# EAGLE design GLCD-Shield_v10 (EAGLE 7.5.0)
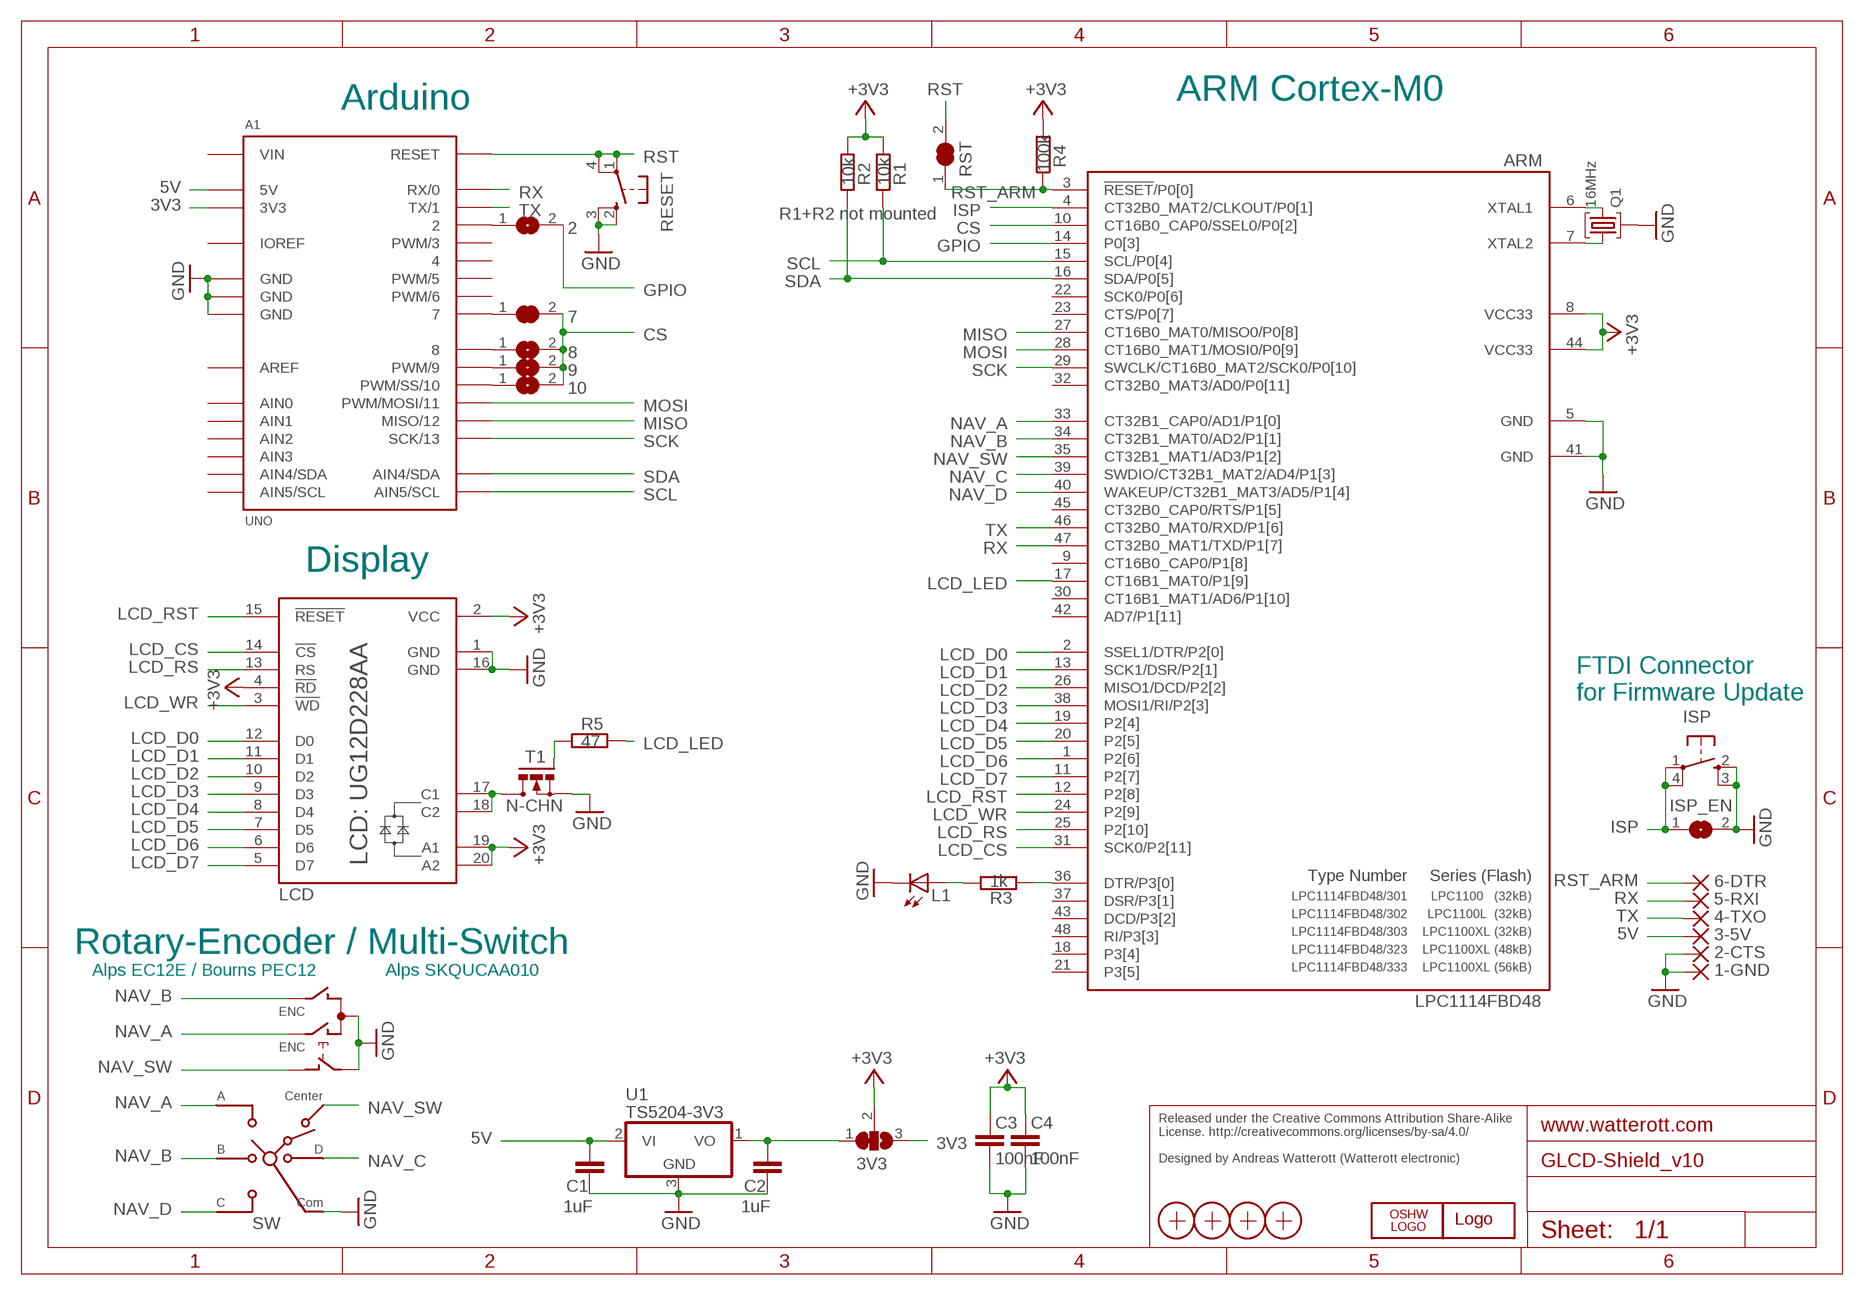
[diagram p0: schematic, sheet 1]

## Parts
1-GND  WIREPADSMD1,27-254  [SMD1,27-2,54]
2  SJ  [SJ]
2-CTS  WIREPADSMD1,27-254  [SMD1,27-2,54]
3-5V  WIREPADSMD1,27-254  [SMD1,27-2,54]
3V3  SJ2W  [SJ_2]
4-TXO  WIREPADSMD1,27-254  [SMD1,27-2,54]
5-RXI  WIREPADSMD1,27-254  [SMD1,27-2,54]
6-DTR  WIREPADSMD1,27-254  [SMD1,27-2,54]
7  SJ  [SJ]
8  SJ  [SJ]
9  SJ  [SJ]
10  SJ  [SJ]
A1  UNO  [UNO]
ARM  LPC1114FBD48  LPC111X  [LQFP48]
C1  1uF  C-EUC0603  [C0603]
C2  1uF  C-EUC0603  [C0603]
C3  100nF  C-EUC0603  [C0603]
C4  100nF  C-EUC0603  [C0603]
ENC  EC12E_SW  [ALPS_EC12E_SW]
ISP  SW_SMDS  [SW_SMD4@1]
ISP_EN  SJ  [SJ]
L1  LEDCHIPLED_0603  [CHIPLED_0603]
LCD  UG12D228AA  [UG12D228AA]
LOGO1  OSHW_LOGO_6MILX0100-NT  [OSHW_6X100_NOTEXT]
Q1  16MHz  SMD_OSC2  [SMD_OSC_35X15]
R1  10k  R-EU_R0603  [R0603]
R2  10k  R-EU_R0603  [R0603]
R3  1k  R-EU_R0603  [R0603]
R4  100k  R-EU_R0603  [R0603]
R5  47  R-EU_R0603  [R0603]
RESET  SW_SMDS  [SW_SMD4@1]
RST  SJ  [SJ]
SW  SKQUCAA010  [SKQU]
T1  N-CHN  IRLML2502  [MICRO3]
U1  TS5204-3V3  TS5204  [SOT23]
U$1  WE-LOGOPLACE  [WE-LOGO]
X1  PASSER  [PASSER]
X2  PASSER  [PASSER]
X3  PASSER  [PASSER]
X4  PASSER  [PASSER]

## Nets
2X: 2.1 A1.2
3V3: 3V3.3 A1.3V3
3V_OUT: 3V3.1 C2.1 U1.1(VO)
5V: 3-5V.1(P) A1.5V C1.1 U1.2(VI)
7: 7.1 A1.7
8: 8.1 A1.8
9: 9.1 A1.9(PWM/9)
10: 10.1 A1.10(PWM/SS/10)
+3V3: 3V3.2 ARM.8(VCC33) ARM.44(VCC33) C3.1 C4.1 LCD.2(VCC) LCD.4(!RD) LCD.19(A1) LCD.20(A2) R1.2 R2.2 R4.2
C: LCD.17(C1) LCD.18(C2) T1.3(D)
CS: 7.2 8.2 9.2 10.2 ARM.10(CT16B0_CAP0/SSEL0/P0[2])
GND: 1-GND.1(P) 2-CTS.1(P) A1.GND@1(GND) A1.GND@2(GND) A1.GND@3(GND) ARM.5(GND) ARM.41(GND) C1.2 C2.2 C3.2 C4.2 ENC.C ENC.E ISP.2(S) ISP.3(S1) ISP_EN.2 L1.C LCD.1(GND) LCD.16(GND) Q1.GND RESET.2(S) RESET.3(S1) SW.COMMON T1.2(S) U1.3(GND)
GPIO: 2.2 ARM.14(P0[3])
ISP: ARM.4(CT32B0_MAT2/CLKOUT/P0[1]) ISP.1(P) ISP.4(P1) ISP_EN.1
LCD_CS: ARM.31(SCK0/P2[11]) LCD.14(!CS)
LCD_D0: ARM.2(SSEL1/DTR/P2[0]) LCD.12(D0)
LCD_D1: ARM.13(SCK1/DSR/P2[1]) LCD.11(D1)
LCD_D2: ARM.26(MISO1/DCD/P2[2]) LCD.10(D2)
LCD_D3: ARM.38(MOSI1/RI/P2[3]) LCD.9(D3)
LCD_D4: ARM.19(P2[4]) LCD.8(D4)
LCD_D5: ARM.20(P2[5]) LCD.7(D5)
LCD_D6: ARM.1(P2[6]) LCD.6(D6)
LCD_D7: ARM.11(P2[7]) LCD.5(D7)
LCD_LED: ARM.17(CT16B1_MAT0/P1[9]) R5.2
LCD_RS: ARM.25(P2[10]) LCD.13(RS)
LCD_RST: ARM.12(P2[8]) LCD.15(!RESET)
LCD_WR: ARM.24(P2[9]) LCD.3(!WD)
LED: ARM.36(DTR/P3[0]) R3.1
LEDPWM: R5.1 T1.1(G)
MISO: A1.12(MISO/12) ARM.27(CT16B0_MAT0/MISO0/P0[8])
MOSI: A1.11(PWM/MOSI/11) ARM.28(CT16B0_MAT1/MOSI0/P0[9])
N$1: ARM.6(XTAL1) Q1.2
N$5: ARM.7(XTAL2) Q1.1
N$12: L1.A R3.2
NAV_A: ARM.33(CT32B1_CAP0/AD1/P1[0]) ENC.A SW.A
NAV_B: ARM.34(CT32B1_MAT0/AD2/P1[1]) ENC.B SW.B
NAV_C: ARM.39(SWDIO/CT32B1_MAT2/AD4/P1[3]) SW.D
NAV_D: ARM.40(WAKEUP/CT32B1_MAT3/AD5/P1[4]) SW.C
NAV_SW: ARM.35(CT32B1_MAT1/AD3/P1[2]) ENC.D SW.CENTER
RST: A1.RST(RESET) RESET.1(P) RESET.4(P1) RST.2
RST_ARM: 6-DTR.1(P) ARM.3(!RESET!/P0[0]) R4.1 RST.1
RX: 5-RXI.1(P) A1.0(RX/0) ARM.47(CT32B0_MAT1/TXD/P1[7])
SCK: A1.13(SCK/13) ARM.29(SWCLK/CT16B0_MAT2/SCK0/P0[10])
SCL: A1.SCL(AIN5/SCL) ARM.15(SCL/P0[4]) R1.1
SDA: A1.SDA(AIN4/SDA) ARM.16(SDA/P0[5]) R2.1
TX: 4-TXO.1(P) A1.1(TX/1) ARM.46(CT32B0_MAT0/RXD/P1[6])
Unconnected: A1.3(PWM/3) A1.4 A1.5(PWM/5) A1.6(PWM/6) A1.AIN0 A1.AIN1 A1.AIN2 A1.AIN3 A1.AIN4(AIN4/SDA) A1.AIN5(AIN5/SCL) ARM.9(CT16B0_CAP0/P1[8]) ARM.18(P3[4]) ARM.21(P3[5]) ARM.22(SCK0/P0[6]) ARM.23(CTS/P0[7]) ARM.30(CT16B1_MAT1/AD6/P1[10]) ARM.32(CT32B0_MAT3/AD0/P0[11]) ARM.37(DSR/P3[1]) ARM.42(AD7/P1[11]) ARM.43(DCD/P3[2]) ARM.45(CT32B0_CAP0/RTS/P1[5]) ARM.48(RI/P3[3]) ENC.GND1(G) ENC.GND2(G)

## Notes on the sheet
- Arduino | ARM Cortex-M0
- R1+R2 not mounted
- Display
- FTDI Connector
- for Firmware Update
- Type Number | Series (Flash)
- LPC1114FBD48/301 | LPC1100   (32kB)
- LPC1114FBD48/302 | LPC1100L  (32kB)
- LPC1114FBD48/303 | LPC1100XL (32kB)
- LPC1114FBD48/323 | LPC1100XL (48kB)
- Rotary-Encoder / Multi-Switch
- LPC1114FBD48/333 | LPC1100XL (56kB)
- Alps EC12E / Bourns PEC12 | Alps SKQUCAA010
- Released under the Creative Commons Attribution Share-Alike 
  License. http://creativecommons.org/licenses/by-sa/4.0/
  
  Designed by Andreas Watterott (Watterott electronic)

## Power pins joined to a net without a drawn wire
AREF: A1.AREF
IOREF: A1.IOREF
VIN: A1.VIN

## Library data of the parts
1-GND 2-CTS 3-5V 4-TXO 5-RXI 6-DTR = wirepad:WIREPAD: Wire PAD connect wire on PCB
2 7-10 ISP_EN RST = jumper:SJ: SMD solder JUMPER
3V3 = jumper:SJ2W: SMD solder JUMPER
A1 = Arduino:UNO
ARM = ARM:LPC111X: NXP LPC1113/14
C1-C4 = rcl:C-EU: CAPACITOR, European symbol
ENC = Encoder-IR:EC12E_SW: ALPS EC12E Rotary Encoder with switch
ISP RESET = Switch-SMD:SW_SMD
L1 = led:LED: LED OSRAM: - CHIPLED LG R971, LG N971, LY N971, LG Q971, LY Q971, LO R971, LY R971 LH N974, LH R974 LS Q976, LO Q976, LY Q976 LO Q996 - Hyper CHIPLED LW Q18S LB Q993, LB Q99A, LB R99A - SideLED LS A670, LO A670, LY A670, LG A670, LP A670 LB A673, LV A673, LT A673, LW A673 LH A674 LY A675 LS A676, LA A676, LO A676, LY A676, LW A676 LS A679, LY A679, LG A679 - Hyper Micro SIDELED® LS Y876, LA Y876, LO Y876, LY Y876 LT Y87S - SmartLED LW L88C, LW L88S LB L89C, LB L89S, LG L890 LS L89K, LO L89K, LY L89K LS L896, LA L896, LO L896, LY L896 - TOPLED LS T670, LO T670, LY T670, LG T670, LP T670 LSG T670, LSP T670, LSY T670, LOP T670, LYG T670 LG T671, LOG T671, LSG T671 LB T673, LV T673, LT T673, LW T673 LH T674 LS T676, LA T676, LO T676, LY T676, LB T676, LH T676, LSB T676, LW T676 LB T67C, LV T67C, LT T67C, LS T67K, LO T67K, LY T67K, LW E67C LS E67B, LA E67B, LO E67B, LY E67B, LB E67C, LV E67C, LT E67C LW T67C LS T679, LY T679, LG T679 LS T770, LO T770, LY T770, LG T770, LP T770 LB T773, LV T773, LT T773, LW T773 LH T774 LS E675, LA E675, LY E675, LS T675 LS T776, LA T776, LO T776, LY T776, LB T776 LHGB T686 LT T68C, LB T68C - Hyper Mini TOPLED® LB M676 - Mini TOPLED Santana® LG M470 LS M47K, LO M47K, LY M47K Source: http://www.osram.convergy.de LUXEON: - LUMILED® LXK2-PW12-R00, LXK2-PW12-S00, LXK2-PW14-U00, LXK2-PW14-V00 LXK2-PM12-R00, LXK2-PM12-S00, LXK2-PM14-U00 LXK2-PE12-Q00, LXK2-PE12-R00, LXK2-PE12-S00, LXK2-PE14-T00, LXK2-PE14-U00 LXK2-PB12-K00, LXK2-PB12-L00, LXK2-PB12-M00, LXK2-PB14-N00, LXK2-PB14-P00, LXK2-PB14-Q00 LXK2-PR12-L00, LXK2-PR12-M00, LXK2-PR14-Q00, LXK2-PR14-R00 LXK2-PD12-Q00, LXK2-PD12-R00, LXK2-PD12-S00 LXK2-PH12-R00, LXK2-PH12-S00 LXK2-PL12-P00, LXK2-PL12-Q00, LXK2-PL12-R00 Source: www.luxeon.com KINGBRIGHT: KA-3528ASYC Source: www.kingbright.com
LCD = Display:UG12D228AA: Samsung UG12D228AA
LOGO1 = OSHW:OSHW_LOGO_6MIL
Q1 = Crystal:SMD_OSC
R1-R5 = rcl:R-EU_: RESISTOR, European symbol
SW = Encoder-Nav-IR:SKQU: Multi Control Devices TACT Switch - 4-directional with Center Push Type. SKQU Series.; MF: ALPS; OC_ADAFRUIT: 504; OC_MOUSER: 688-SKQUCA; OC_NEWARK: 59M1983
T1 = IRF-sot23:IRLML2502: N-Channel Power MOSFET
U1 = Voltage-Reg:TS5204
U$1 = welectronic:WE-LOGO
X1-X4 = SMD:PASSER

## Board
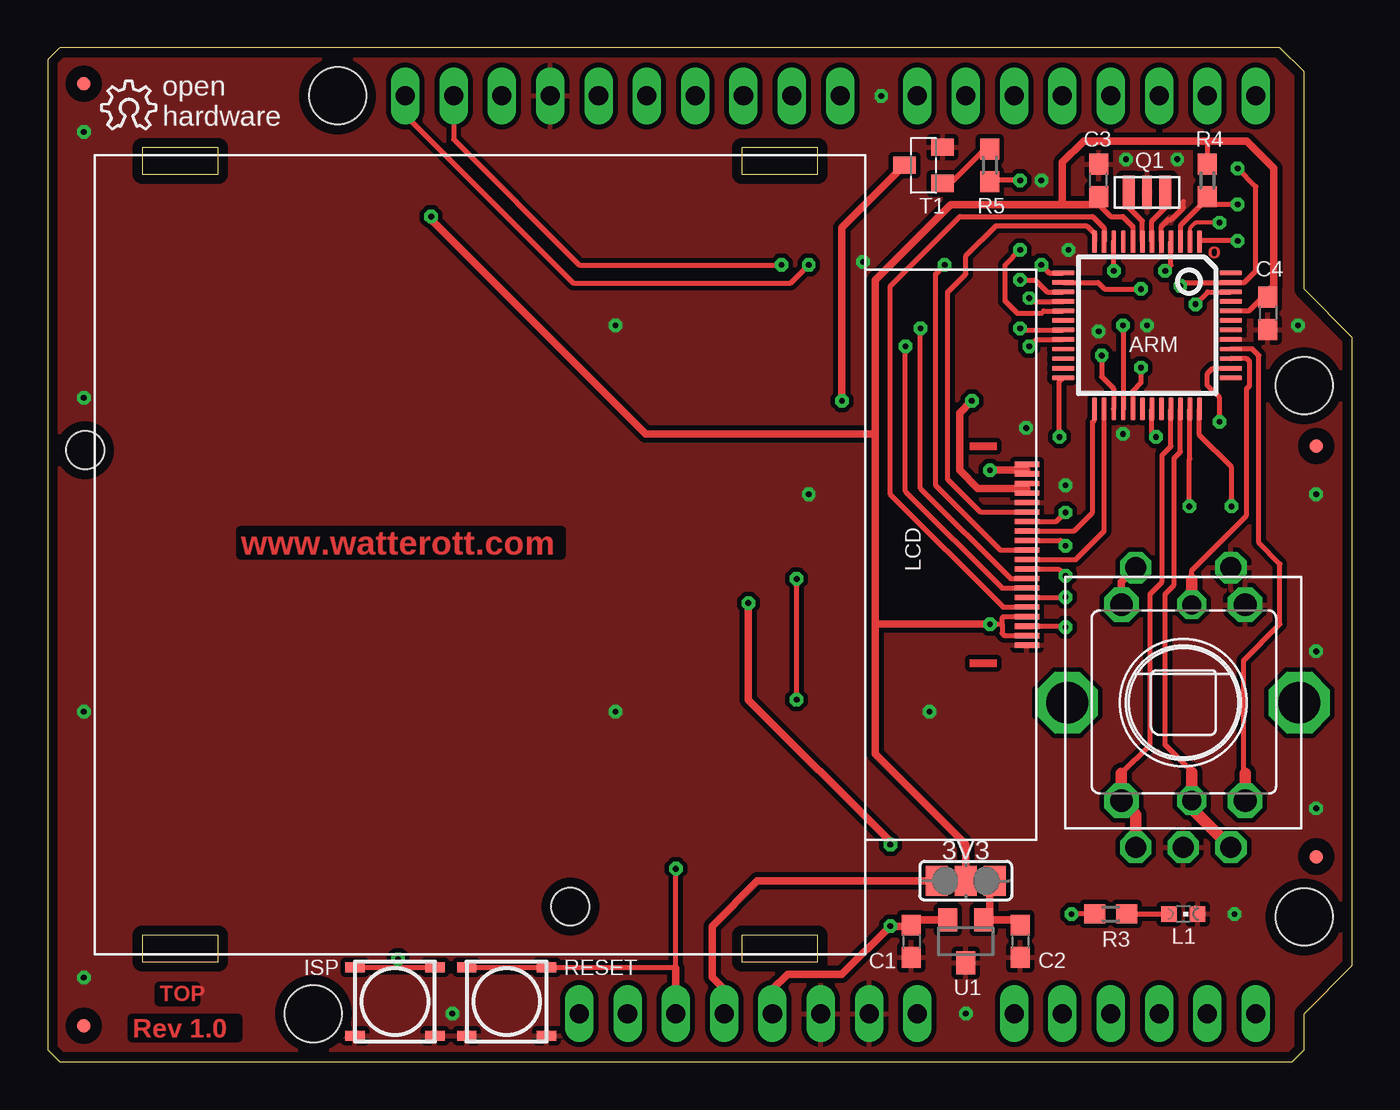
[diagram p1: board, top side]
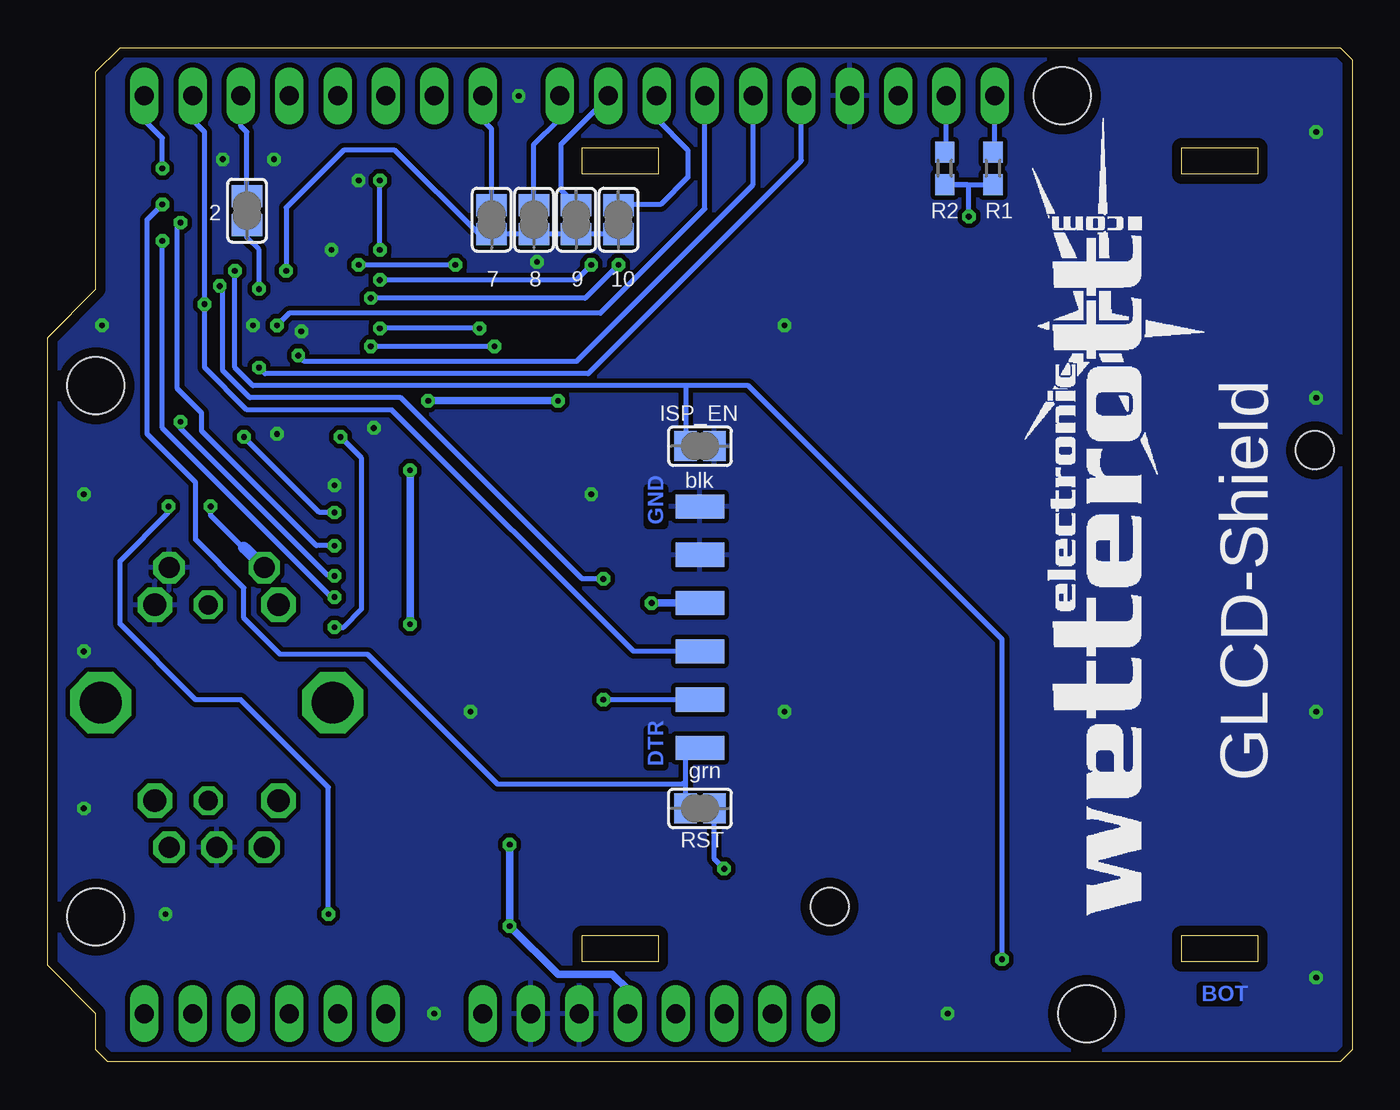
[diagram p2: board, bottom side, seen from below]

Size 68.58 x 53.34 mm. Coordinates in mm from the lower left corner, seen from the top.
Copper layers (1*16): Top 0.035mm / dielectric 1.5mm / Bottom 0.035mm
Design rules "default *": minimum track width 8mil, minimum drill 0.3mm, track to track 8mil, track to pad 8mil, pad to pad 8mil, via to via 8mil, smd to smd 8mil, copper to edge 20mil, drill to drill 8mil, minimum pad ring 10mil, minimum via ring 8mil, stop-mask expansion 4mil, vias tented up to drill 0.5mm, thermal gap 10mil
tRestrict: area 56.5,44.9 to 57.1,46.5; area 58.4,44.9 to 59.1,46.5

### Footprints (pad centres in the part's own frame; a part is rotated, then mirrored left to right if it is on the bottom)
SMD1,27-2,54 = smd 1.27 x 2.54: 1 0,0
SJ = smd 1.168 x 1.6: 1 -0.762,0; 2 0.762,0
SJ_2 = smd 1.168 x 1.6: 1 -1.524,0; 2 0,0; 3 1.524,0
UNO = drill 1 long: 0 63.5,50.8; 1 60.96,50.8; 2 58.42,50.8; 3 55.88,50.8; 3V3 35.56,2.54; 4 53.34,50.8; 5 50.8,50.8; 5V 38.1,2.54; 6 48.26,50.8; 7 45.72,50.8; 8 41.656,50.8; 9 39.116,50.8; 10 36.576,50.8; 11 34.036,50.8; 12 31.496,50.8; 13 28.956,50.8; AIN0 50.8,2.54; AIN1 53.34,2.54; AIN2 55.88,2.54; AIN3 58.42,2.54; AIN4 60.96,2.54; AIN5 63.5,2.54; AREF 23.876,50.8; GND@1 40.64,2.54; GND@2 43.18,2.54; GND@3 26.416,50.8; IOREF 30.48,2.54; NC 27.94,2.54; RST 33.02,2.54; SCL 18.796,50.8; SDA 21.336,50.8; VIN 45.72,2.54 | hole 3: 66.04,35.56; 66.04,7.62; 15.24,50.8; 13.97,2.54
LQFP48 = smd 1.2 x 0.26: 1 -4.4,2.75; 2 -4.4,2.25; 3 -4.4,1.75; 4 -4.4,1.25; 5 -4.4,0.75; 6 -4.4,0.25; 7 -4.4,-0.25; 8 -4.4,-0.75; 9 -4.4,-1.25; 10 -4.4,-1.75; 11 -4.4,-2.25; 12 -4.4,-2.75; 25 4.4,-2.75; 26 4.4,-2.25; 27 4.4,-1.75; 28 4.4,-1.25; 29 4.4,-0.75; 30 4.4,-0.25; 31 4.4,0.25; 32 4.4,0.75; 33 4.4,1.25; 34 4.4,1.75; 35 4.4,2.25; 36 4.4,2.75 | smd 0.26 x 1.2: 13 -2.75,-4.4; 14 -2.25,-4.4; 15 -1.75,-4.4; 16 -1.25,-4.4; 17 -0.75,-4.4; 18 -0.25,-4.4; 19 0.25,-4.4; 20 0.75,-4.4; 21 1.25,-4.4; 22 1.75,-4.4; 23 2.25,-4.4; 24 2.75,-4.4; 37 2.75,4.4; 38 2.25,4.4; 39 1.75,4.4; 40 1.25,4.4; 41 0.75,4.4; 42 0.25,4.4; 43 -0.25,4.4; 44 -0.75,4.4; 45 -1.25,4.4; 46 -1.75,4.4; 47 -2.25,4.4; 48 -2.75,4.4
C0603 = smd 1.1 x 1: 1 -0.85,0; 2 0.85,0
ALPS_EC12E_SW = drill 1.1 octagon: A -2.5,-7.6; B 2.5,-7.6; C 0,-7.6; D -2.5,7.1; E 2.5,7.1 | drill 2.2 octagon: GND1 -6.1,0; GND2 6.1,0
SW_SMD4@1 = smd 0.508 x 1.016: 1 -1.8,-2.1; 2 1.8,-2.1; 3 1.8,2.1; 4 -1.8,2.1
CHIPLED_0603 = smd 0.8 x 0.8: A 0,-0.75; C 0,0.75
UG12D228AA = smd 0.279 x 1.27: 1 -4.75,-7.5; 2 -4.25,-7.5; 3 -3.75,-7.5; 4 -3.25,-7.5; 5 -2.75,-7.5; 6 -2.25,-7.5; 7 -1.75,-7.5; 8 -1.25,-7.5; 9 -0.75,-7.5; 10 -0.25,-7.5; 11 0.25,-7.5; 12 0.75,-7.5; 13 1.25,-7.5; 14 1.75,-7.5; 15 2.25,-7.5; 16 2.75,-7.5; 17 3.25,-7.5; 18 3.75,-7.5; 19 4.25,-7.5; 20 4.75,-7.5 | hole 2: 5.5,42; -18.5,16.5
SMD_OSC_35X15 = smd 0.635 x 1.778: 1 -0.965,0; 2 0.965,0 | smd 0.508 x 1.778: GND 0,0
R0603 = smd 1.1 x 1: 1 -0.85,0; 2 0.85,0
SKQU = drill 1.2 octagon: A -5.15,3.25; C -5.15,-3.25; CENTER 5.15,3.25; COMMON 5.15,-3.25 | drill 1 octagon: B -5.15,-0.45; D 5.15,-0.45
MICRO3 = smd 0.9 x 1.2: 1 -0.95,-1; 2 0.95,-1; 3 0,1
SOT23 = smd 1 x 1.2: 1 -0.95,-1.132; 2 0.95,-1.132; 3 0,1.132
PASSER = smd 0.7 x 0.7: X 0,0

### Placement (x,y rotation side)
1-GND  34.29,29.21 270 bottom
2  58.1,44.77 270 bottom
2-CTS  34.29,26.67 270 bottom
3-5V  34.29,24.13 270 bottom
3V3  48.26,9.53 180 top
4-TXO  34.29,21.59 270 bottom
5-RXI  34.29,19.05 270 bottom
6-DTR  34.29,16.51 270 bottom
7  45.24,44.29 270 bottom
8  43.02,44.29 270 bottom
9  40.8,44.29 270 bottom
10  38.58,44.29 270 bottom
A1  0,0 0 top
ARM  57.78,38.73 270 top
C1  45.4,6.35 270 top
C2  51.12,6.35 270 top
C3  55.24,46.35 90 top
C4  64.14,39.37 270 top
ENC  59.69,18.89 0 top
ISP  18.26,3.17 270 top
ISP_EN  34.29,32.38 0 bottom
L1  59.69,7.78 270 top
LCD  43.97,26.67 90 top
LOGO1  2.86,49.05 0 top
Q1  57.78,45.72 0 top
R1  18.89,46.99 270 bottom
R2  21.43,46.99 270 bottom
R3  55.88,7.78 0 top
R4  60.96,46.35 90 top
R5  49.53,47.15 270 top
RESET  24.13,3.17 270 top
RST  34.29,13.34 0 bottom
SW  59.69,18.89 90 top
T1  46.04,47.15 90 top
U1  48.26,6.35 180 top
U$1  7.46,7.46 90 bottom
X1  1.91,1.91 0 top
X2  1.91,51.44 0 top
X3  66.67,32.38 0 top
X4  66.67,10.79 0 top

### Tracks (layer width: path | path; a pad name or v marks a point on that pad's centre or on a via)
2X
  Bottom 0.254: A1.2 58.42,49.21 58.1,48.9 2.1
3V3
  Top 0.406: A1.3V3 35.56,3.81 34.92,4.45 34.92,7.14 37.31,9.53 3V3.3
3V_OUT
  Top 0.254: 49.53,9.53 3V3.1
  Top 0.406: C2.1 50.84,7.48 U1.1 49.53,7.8 49.53,9.53
5V  (via drill 0.3)
  Top 0.406: U1.2 45.68,7.48 C1.1 45.35,7.14 v44.29,7.14 41.75,4.6 38.89,4.6 38.1,3.81 A1.5V | v44.29,11.43 44.29,11.59 36.83,19.05 v36.83,24.13
  Bottom 0.406: A1.5V 38.1,3.81 38.89,4.6 41.75,4.6 v44.29,7.14 v44.29,11.43 | v36.83,24.13 3-5V.1
7
  Bottom 0.254: A1.7 45.72,49.53 45.24,49.05 7.1
8
  Bottom 0.254: 8.1 43.02,48.26 41.75,49.53 41.75,50.7 A1.8
9
  Bottom 0.254: A1.9 39.12,50.74 41.59,48.26 41.59,45.85 9.1
10
  Bottom 0.254: A1.10 36.58,49.59 34.92,47.94 34.92,46.51 36.35,45.09 38.55,45.09 10.1
+3V3  (via drill 0.3)
  Top 0.254: LCD.2 50.29,22.42 50.16,22.54 50.16,23.02 | LCD.4 50.25,23.42 50.16,23.34 50.16,23.02 | 60.96,48.42 R4.2 | ARM.8 57.03,43.93 56.52,44.45 55.88,44.45 55.24,45.09 C3.1 | ARM.44 63.14,39.48 63.82,40.16 64.08,40.16 C4.1 | LCD.19 51.47,31.11 LCD.20 | v49.53,23.02 50.16,23.02
  Top 0.406: 63.82,40.16 64.45,40.8 64.45,46.99 63.02,48.42 60.96,48.42 54.45,48.42 53.34,47.31 53.34,45.09 | 53.34,45.09 55.24,45.09 | 53.34,45.09 47.47,45.09 43.5,41.12 43.5,33.02 | 3V3.2 48.26,11.43 43.5,16.19 43.5,23.02 | 43.5,23.02 43.5,33.02 | 43.5,33.02 31.43,33.02 20.16,44.29 v20.16,44.45 | 43.5,23.02 v49.53,23.02 | 49.69,31.11 51.47,31.11 | v49.53,31.11 49.69,31.11 | 49.69,31.11
  Bottom 0.254: R2.2 R1.2 | R2.2 | R2.2 20.26,46.14 20.16,46.04 v20.16,44.45
  Bottom 0.406: v49.53,23.02 v49.53,31.11
C  (via drill 0.3)
  Top 0.254: LCD.17 51.47,30.16 LCD.18
  Top 0.406: v41.75,34.77 41.75,43.86 T1.3 | v48.58,34.77 47.94,34.13 47.94,31.11 48.9,30.16 51.47,30.16
  Bottom 0.254: v48.58,34.77
  Bottom 0.406: v41.75,34.77 v48.58,34.77
CS  (via drill 0.3)
  Top 0.254: ARM.10 v56.03,41.6 v56.04,41.59
  Bottom 0.254: v56.04,41.59 56.04,44.93 53.02,47.94 50.32,47.94 45.88,43.5 45.28,43.5 7.2 8.2 9.2 | 10.2 9.2 | 9.2
GND  (via drill 0.3)
  Top 0.254: ARM.5 58.53,43.93 58.9,44.29 59.05,44.29 59.69,44.93 59.69,45.24
  other vias: 1.91,34.92 1.91,18.41 56.67,47.47 52.23,46.35 53.5,30.32 65.72,38.73 42.86,42.07 57.78,38.74 51.44,33.34 53.66,42.7 59.37,47.47 66.67,13.34 66.67,29.85 48.26,2.54 46.35,18.42 1.91,4.45 1.91,48.9 29.84,18.42 29.84,38.74 21.27,2.54 40.01,29.85 56.52,33.02 62.39,7.78 66.67,21.59 43.81,50.8 55.25,38.42
  pour Bottom (isolate 0.254): 0,53.34 68.58,53.34 68.58,0 0,0
  pour Top (isolate 0.254): 0,0 0,53.34 68.58,53.34 68.58,0
GPIO  (via drill 0.3)
  Top 0.254: ARM.14 55.22,40.98 55.56,40.64 v57.47,40.64
  Bottom 0.254: 2.2 58.1,43.34 57.47,42.7 v57.47,40.64
ISP  (via drill 0.3)
  Top 0.254: ARM.4 59.03,41.89 v58.74,41.59 | ISP.1 18.57,4.97 | 18.57,4.97 ISP.4 | v18.41,5.4 18.41,5.13 18.57,4.97
  Bottom 0.254: v58.74,41.59 58.74,36.51 57.78,35.56 35.08,35.56 | 35.24,32.58 ISP_EN.1 35.05,35.53 35.08,35.56 | v18.41,5.4 18.41,22.23 31.75,35.56 35.08,35.56
LCD_CS  (via drill 0.3)
  Top 0.254: LCD.14 53.03,28.42 v53.5,28.89 | ARM.31 58.03,33.09 v58.26,32.86
  Bottom 0.254: v53.5,28.89 54.29,28.89 v58.26,32.86
LCD_D0  (via drill 0.3)
  Top 0.203: ARM.2 60.03,43.84 60.33,44.13 v61.59,44.13
  Top 0.254: LCD.12 53.23,27.42 v53.5,27.15
  Bottom 0.254: v61.59,44.13 61.75,43.97 61.75,35.4 60.48,34.13 60.48,33.18 54.45,27.15 v53.5,27.15 | v61.59,44.13 | v53.5,27.15
LCD_D1  (via drill 0.3)
  Top 0.254: ARM.13 52.65,41.48 v52.23,41.91 | LCD.11 50.07,26.92 46.67,30.32 46.67,41.43 v47.15,41.91
  Bottom 0.254: v47.15,41.91 v52.23,41.91
LCD_D2
  Top 0.254: ARM.26 55.53,27.91 54.04,26.42 LCD.10
LCD_D3  (via drill 0.3)
  Top 0.254: LCD.9 53.14,25.92 v53.5,25.56 | v61.59,33.66 61.59,34.92 60.96,35.56 60.96,36.2 61.25,36.48 ARM.38
  Bottom 0.254: v53.5,25.56 53.82,25.56 61.59,33.34 v61.59,33.66
LCD_D4  (via drill 0.3)
  Top 0.254: ARM.19 51.21,38.48 v51.12,38.58 | LCD.8 50.62,25.42 45.88,30.16 v45.88,38.58 | v45.88,38.58
  Bottom 0.254: v45.88,38.58 v51.12,38.58
LCD_D5  (via drill 0.3)
  Top 0.254: ARM.20 51.95,37.98 v51.59,37.62 | LCD.7 50.17,24.92 45.09,30 v45.09,37.62
  Bottom 0.254: v45.09,37.62 v51.59,37.62
LCD_D6  (via drill 0.3)
  Top 0.254: LCD.6 53.47,24.42 v53.5,24.45 | v62.55,43.18 60.64,43.18 60.6,43.13 ARM.1
  Bottom 0.254: v53.5,24.45 53.66,24.45 62.55,33.34 v62.55,43.18 | v62.55,43.18
LCD_D7
  Top 0.254: ARM.11 55.53,43.84 54.93,44.45 47.94,44.45 44.29,40.8 44.29,29.84 50.22,23.92 LCD.5
LCD_LED  (via drill 0.3)
  Top 0.254: ARM.17 52.34,39.48 52.23,39.37 50.96,39.37 50.32,40.01 50.32,41.91 v51.12,42.7 | v51.12,46.35 49.59,46.35 R5.2
  Bottom 0.254: v51.12,42.7 v51.12,46.35
LCD_RS
  Top 0.254: ARM.25 55.03,33.76 54.93,33.66 54.93,28.89 53.95,27.92 LCD.13
LCD_RST
  Top 0.254: ARM.12 55.03,43.55 54.61,43.97 49.85,43.97 48.26,42.39 48.26,41.43 47.31,40.48 47.31,30.64 49.03,28.92 LCD.15
LCD_WR  (via drill 0.3)
  Top 0.254: ARM.24 53.18,35.78 v53.18,32.86 | LCD.3 53.44,22.92 v53.5,22.86
  Bottom 0.254: v53.5,22.86 53.02,22.86 52.07,23.81 52.07,31.75 v53.18,32.86 | v53.18,32.86
LED  (via drill 0.3)
  Top 0.254: 54.61,7.94 54.67,7.88 54.93,7.88 R3.1 v53.82,7.78 | ARM.36 60.53,32.97 62.23,31.27 v62.23,29.21
  Bottom 0.254: v62.23,29.21 62.23,28.89 64.77,26.35 64.77,23.02 60.8,19.05 58.42,19.05 53.82,14.45 v53.82,7.78
LEDPWM
  Top 0.254: T1.1 47.47,46.2 49.21,47.94 49.47,47.94 R5.1
MISO  (via drill 0.3)
  Top 0.254: ARM.27 56.03,35.41 55.4,36.04 v55.4,37.15
  Bottom 0.254: v55.4,37.15 55.09,36.83 40.8,36.83 31.5,46.13 A1.12 | v55.4,37.15
MOSI  (via drill 0.3)
  Top 0.254: ARM.28 56.53,38.72 v56.52,38.73
  Bottom 0.254: v56.52,38.73 55.88,39.37 39.53,39.37 34.04,44.86 A1.11
N$1
  Top 0.254: ARM.6 58.03,44.22 58.74,44.93 58.74,45.71 Q1.2
N$2
  Bottom 0.254: 35.08,13.34 33.5,13.34
N$5
  Top 0.254: ARM.7 57.53,44.22 56.83,44.93 56.83,45.71 Q1.1
N$10
  Bottom 0.254: 45.24,43.66 45.24,44.93
N$12
  Top 0.254: R3.2 | R3.2 L1.A | L1.A
N$31
  Top 0.254: 49.85,9.53 48.26,9.53
NAV_A
  Top 0.254: 56.44,15.16 57.94,16.67 57.94,24.61 58.58,25.24 58.58,31.91 59.03,32.37 ARM.33
  Top 0.61: ENC.A 57.19,12.99 SW.A 56.44,15.16
NAV_B
  Top 0.254: 60.14,15.21 60.17,15.24 58.74,16.67 58.74,24.61 59.21,25.08 59.21,31.75 59.53,32.07 ARM.34
  Top 0.61: 60.14,15.21 SW.B 60.14,13.34 ENC.B
NAV_C
  Top 0.254: ARM.39 63.03,36.98 63.18,36.83 63.18,35.56 63.02,35.4 63.02,28.73 60.14,25.85 60.14,25.37
  Top 0.61: SW.D 60.14,25.37
NAV_D
  Top 0.254: ARM.40 63.32,37.48 63.66,37.15 63.66,27.3 64.77,26.19 64.77,23.02 62.87,21.11 62.87,15.24 62.94,15.16
  Top 0.61: SW.C 62.94,15.16
NAV_SW  (via drill 0.3)
  Top 0.254: ARM.35 60.03,31.72 60.01,31.7 v60.01,29.21
  Top 0.406: SW.CENTER 56.44,25.24 ENC.D
  Bottom 0.254: 58.26,27.06 58.26,27.15 | v60.01,29.21 60.01,28.73 58.26,26.99 58.19,26.99 58.14,26.95
  Bottom 0.61: ENC.D 58.14,26.95 58.26,27.06
RST  (via drill 0.3)
  Top 0.254: RESET.1 RESET.4 32.97,4.97 33.02,4.92 v33.02,10.16
  Top 0.406: 33.02,4.92 A1.RST
  Bottom 0.254: RST.2 33.53,10.67 v33.02,10.16
RST_ARM  (via drill 0.3)
  Top 0.254: ARM.3 59.53,43.98 60.64,45.09 60.64,45.19 R4.1 60.96,45.09 v62.55,45.09
  Bottom 0.254: RST.1 35.05,14.76 | 35.05,14.76 35.05,16.48 35.08,16.51 6-DTR.1 | v62.55,45.09 62.71,44.93 63.34,44.29 63.34,33.02 60.8,30.48 60.8,27.46 58.26,24.92 58.26,23.34 56.36,21.43 51.75,21.43 44.93,14.61 35.21,14.61 35.05,14.76
RX  (via drill 0.3)
  Top 0.254: v62.55,46.99 63.5,46.04 63.5,41.59 62.89,40.98 ARM.47 59.72,40.98 v59.53,40.8 | v39.37,19.05 v39.37,25.4
  Bottom 0.254: v59.53,40.8 59.37,40.64 59.37,36.35 57.94,34.92 50.01,34.92 40.48,25.4 v39.37,25.4 | v62.55,46.99 62.55,48.58 63.5,49.53 A1.0 | 5-RXI.1 v39.37,19.05
SCK  (via drill 0.3)
  Top 0.254: ARM.29 57.03,35.29 57.47,35.72 v57.47,36.51
  Bottom 0.254: v57.47,36.51 57.15,36.2 40.16,36.2 28.96,47.4 A1.13
SCL  (via drill 0.3)
  Top 0.254: ARM.15 52.54,40.48 52.07,40.96 | 52.07,40.96 | 52.07,40.96 51.91,41.12 v51.12,41.12 | v51.12,41.12 | A1.SCL 18.8,49.78 27.62,40.96 39.05,40.96 v40.01,41.91
  Bottom 0.254: A1.SCL 18.8,47.94 R1.1 | v51.12,41.12 40.8,41.12 v40.01,41.91
SDA  (via drill 0.3)
  Top 0.254: ARM.16 51.77,39.98 v51.59,40.16 | A1.SDA 21.34,48.51 27.94,41.91 v38.58,41.91 | v38.58,41.91
  Bottom 0.254: A1.SDA 21.34,47.94 R2.1 | v51.59,40.16 40.32,40.16 v38.58,41.91
TX  (via drill 0.3)
  Top 0.254: ARM.46 60.96,40.48 v60.33,39.85
  Bottom 0.254: A1.1 60.96,49.53 60.33,48.9 v60.33,39.85 | v60.33,39.85 60.33,36.51 58.1,34.29 50.48,34.29 37.78,21.59 4-TXO.1 | v60.33,39.85

### Text on the board
Top: o | www.watterott.com | TOP | Rev 1.0
Bottom: GND | DTR | BOT
tPlace: open | hardware
bPlace: blk | grn | GLCD-Shield
Reference: Silkscreen: 21 tPlace + 25 tNames + 22 bPlace